# EasyEDA schematic WiringDiagram_easyEDA.json
TITLE: Sheet_1; REV: 1.0; Date: 2024-06-22; Sheet: 1/1; Drawn By: maxwelleureka; Company: Your Company
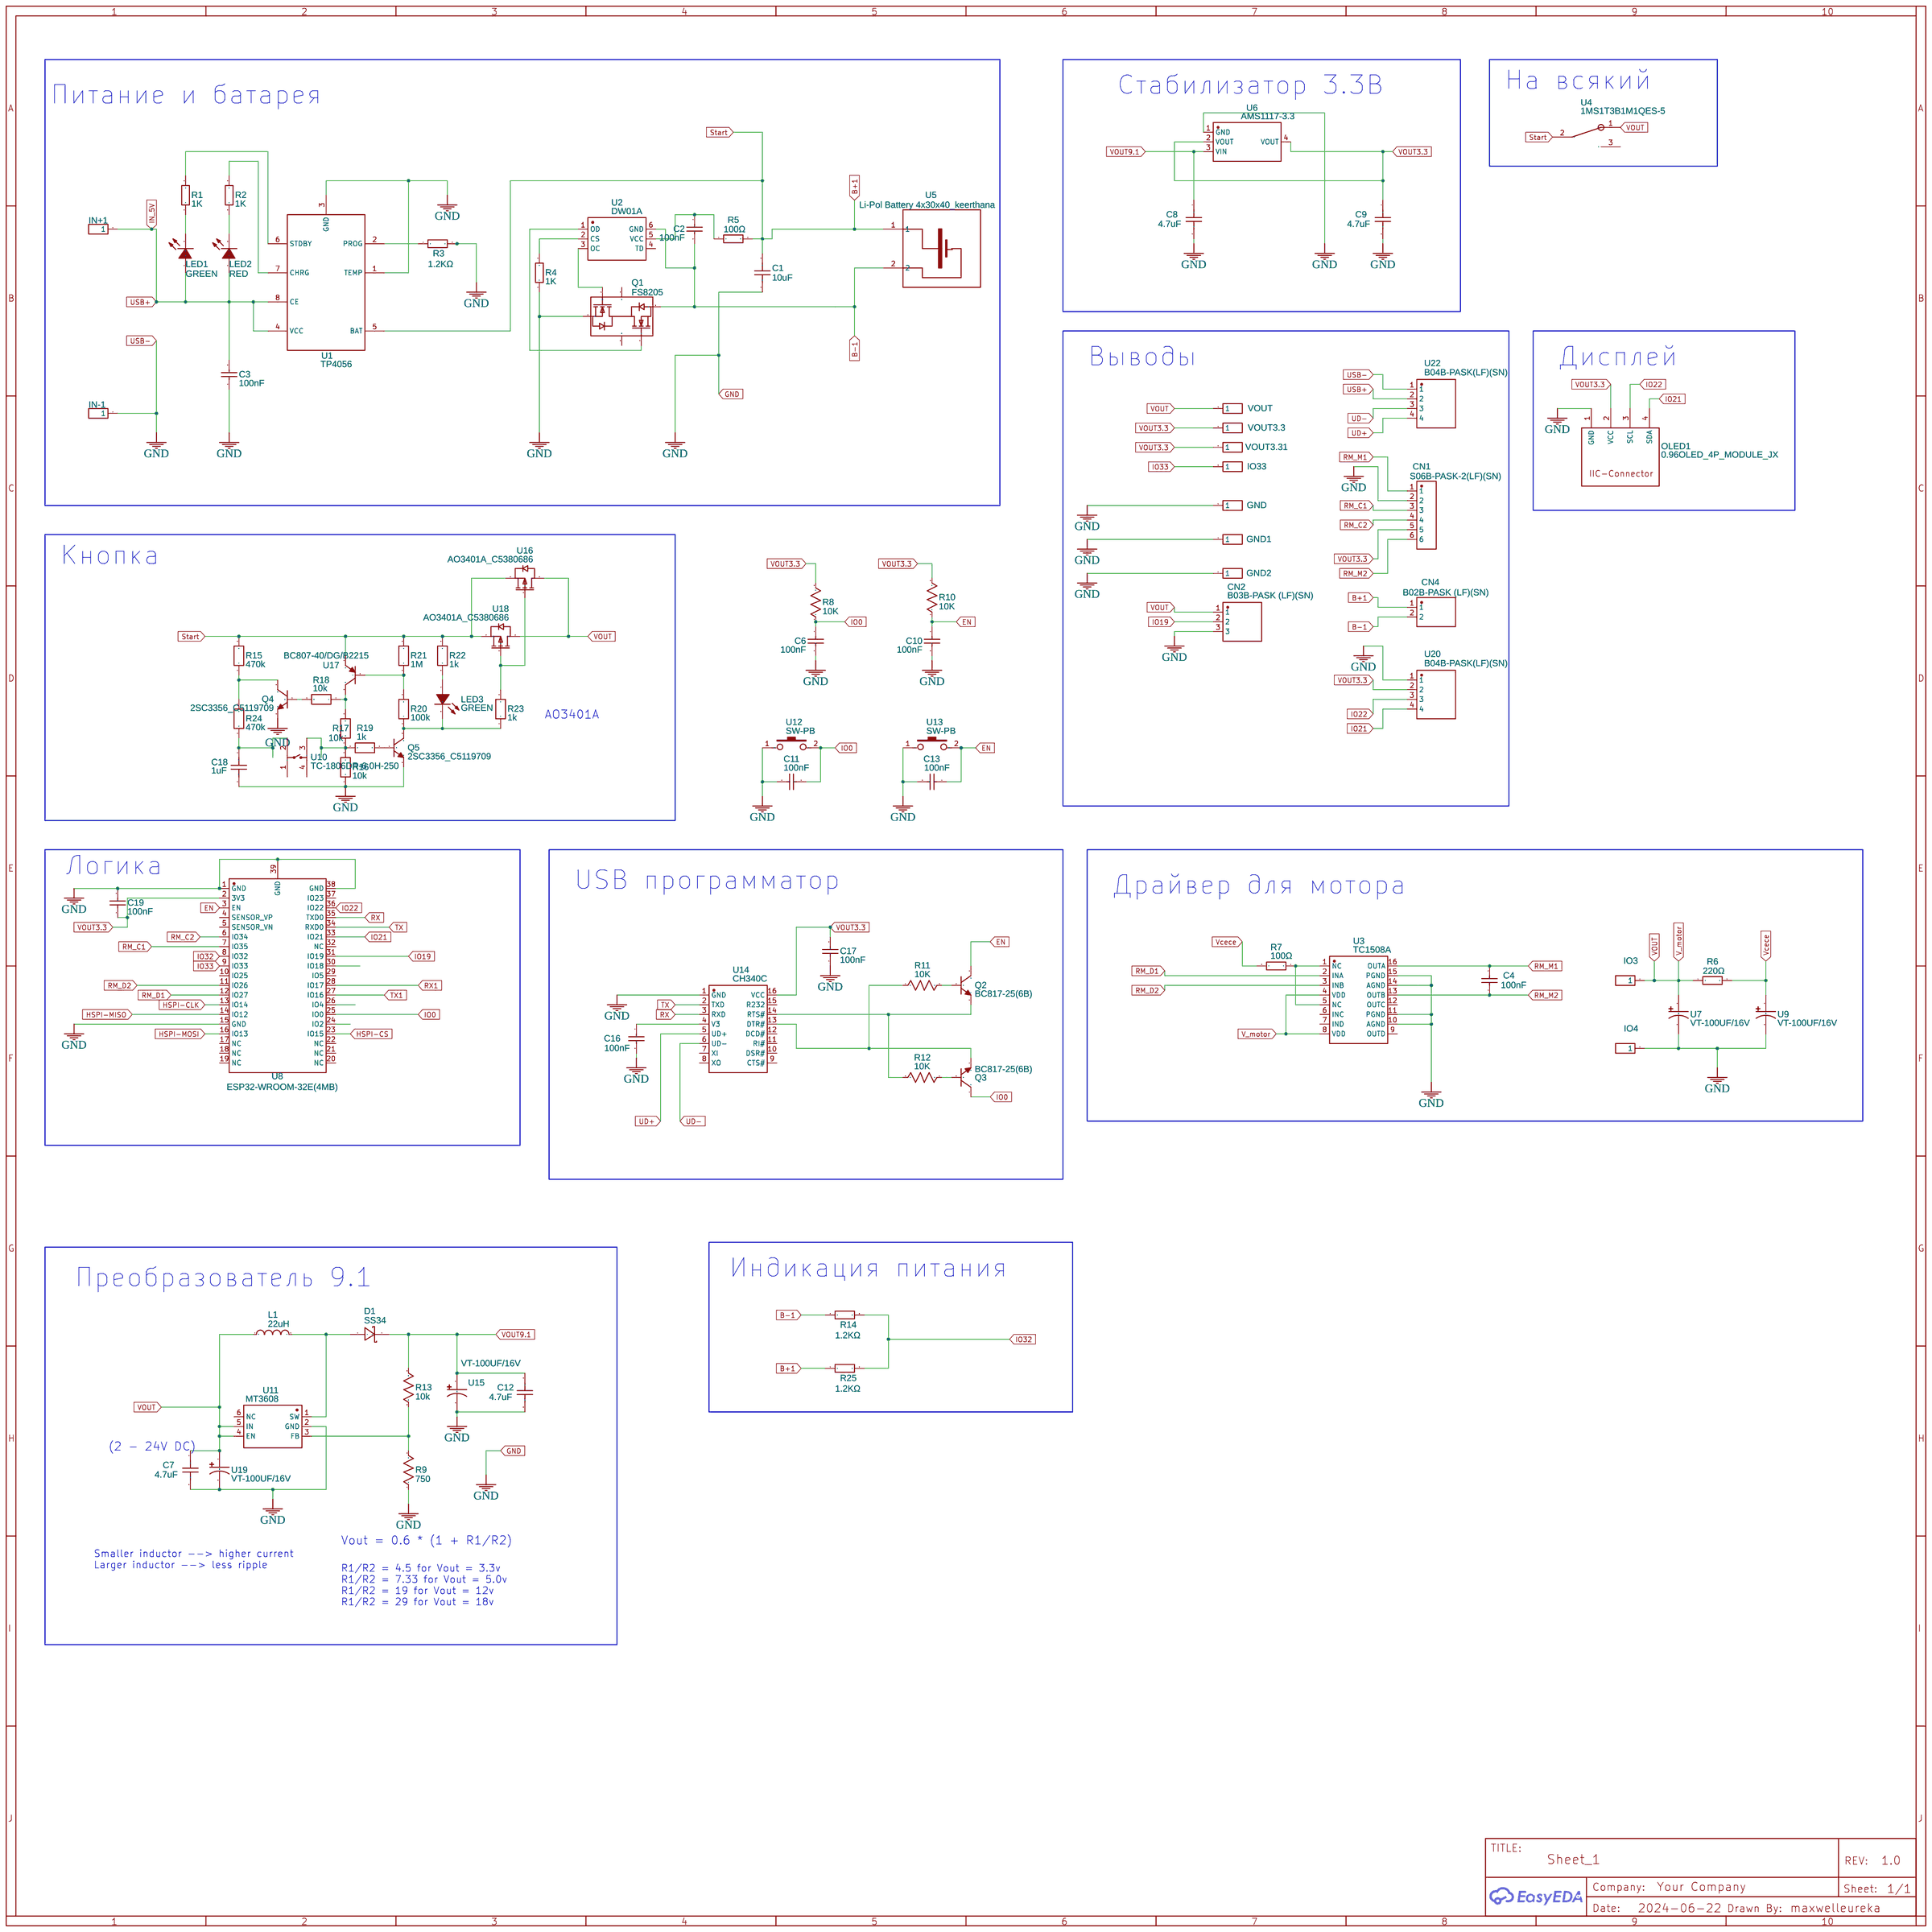
[diagram p0: schematic sheet]

## Parts
C1  10uF  [0603]
C2  100nF  [0603]
C3  100nF  [0603]
C4  100nF  [0603]
C6  100nF  [0603]
C7  4.7uF  [C0805]
C8  4.7uF  [C0805]
C9  4.7uF  [C0805]
C10  100nF  [0603]
C11  100nF  [0603]
C12  4.7uF  [C0805]
C13  100nF  [0603]
C16  100nF  [0603]
C17  100nF  [0603]
C18  1uF  [C0805]
C19  100nF  [0603]
CN1  S06B-PASK-2(LF)(SN)  [CONN-TH_6P-P2.00_S06B-PASK-2-LF-SN]
CN2  B03B-PASK (LF)(SN)  [CONN-TH_B03B-PASK-LF-SN]
CN4  B02B-PASK (LF)(SN)  [CONN-TH_B02B-PAKK-LF-SN]
D1  SS34  [SMA(DO-214AC)]
GND  Header-Male-2.54_1x1  [HDR-1X1/2.54]
GND1  Header-Male-2.54_1x1  [HDR-1X1/2.54]
GND2  Header-Male-2.54_1x1  [HDR-1X1/2.54]
IN+1  Header-Male-2.54_1x1  [HDR-1X1/2.54]
IN-1  Header-Male-2.54_1x1  [HDR-1X1/2.54]
IO3  Header-Male-2.54_1x1  [HDR-1X1/2.54]
IO4  Header-Male-2.54_1x1  [HDR-1X1/2.54]
IO33  Header-Male-2.54_1x1  [HDR-1X1/2.54]
L1  22uH  [7*7*4]
LED1  GREEN  [LED-0603]
LED2  RED  [LED-0603]
LED3  GREEN  [LED-0603]
OLED1  0.96OLED_4P_MODULE_JX  [0.96OLED_4P]
Q1  FS8205  [SOT-23-6]
Q2  BC817-25(6B)  [SOT-23-3_L2.9-W1.6-P1.90-LS2.8-BR]
Q3  BC817-25(6B)  [SOT-23-3_L2.9-W1.6-P1.90-LS2.8-BR]
Q4  2SC3356_C5119709  [SOT-23-3_L2.9-W1.3-P1.90-LS2.4-BR-2]
Q5  2SC3356_C5119709  [SOT-23-3_L2.9-W1.3-P1.90-LS2.4-BR-2]
R1  1K  [0603]
R2  1K  [0603]
R3  1.2KΩ  [0603]
R4  1K  [0603]
R5  100Ω  [0603]
R6  220Ω  [0603]
R7  100Ω  [0603]
R8  10K  [0603]
R9  750  [0603]
R10  10K  [0603]
R11  10K  [0603]
R12  10K  [0603]
R13  10k  [0603]
R14  1.2KΩ  [0603]
R15  470k  [R0805]
R16  10k  [R0805]
R17  10k  [R0805]
R18  10k  [R0805]
R19  1k  [R0805]
R20  100k  [R0805]
R21  1M  [R0805]
R22  1k  [R0805]
R23  1k  [R0805]
R24  470k  [R0805]
R25  1.2KΩ  [0603]
U1  TP4056  [SOP-8_EP_150MIL]
U2  DW01A  [SOT-23-6L]
U3  TC1508A  [SOP-16_L10.0-W3.9-P1.27-LS6.0-BL]
U4  1MS1T3B1M1QES-5  [SW-TH_1MS1T1B1M1QES-5]
U5  Li-Pol Battery 4x30x40_keerthana  [LI-POL-BATTERY-4X30X40]
U6  AMS1117-3.3  [SOT-223-3_L6.5-W3.4-P2.30-LS7.0-BR]
U7  VT-100UF/16V  [CAP-SMD_BD6.3-L6.6-W6.6-FD]
U8  ESP32-WROOM-32E(4MB)  [WIFI-SMD_ESP32-WROOM-32E]
U9  VT-100UF/16V  [CAP-SMD_BD6.3-L6.6-W6.6-FD]
U10  TC-1806DR-6.0H-250  [KEY-TH_4P-L6.0-W6.0-P4.50-LS7.8]
U11  MT3608  [SOT-23-6]
U12  SW-PB  [KEY-SMD_2P-L6.0-W3.6-P7.4-LS8.0-L]
U13  SW-PB  [KEY-SMD_2P-L6.0-W3.6-P7.4-LS8.0-L]
U14  CH340C  [SOIC-16_L9.9-W3.9-P1.27-LS6.0-BL]
U15  VT-100UF/16V  [CAP-SMD_BD6.3-L6.6-W6.6-FD]
U16  AO3401A_C5380686  [SOT-23-3_L2.9-W1.3-P1.90-LS2.4-BR]
U17  BC807-40/DG/B2215  [SOT-23-3_L2.9-W1.6-P1.90-LS2.8-BR]
U18  AO3401A_C5380686  [SOT-23-3_L2.9-W1.3-P1.90-LS2.4-BR]
U19  VT-100UF/16V  [CAP-SMD_BD6.3-L6.6-W6.6-FD]
U20  B04B-PASK(LF)(SN)  [CONN-TH_B04B-PASK-LF-SN]
U22  B04B-PASK(LF)(SN)  [CONN-TH_B04B-PASK-LF-SN]
VOUT  Header-Male-2.54_1x1  [HDR-1X1/2.54]
VOUT3  Header-Male-2.54_1x1  [HDR-1X1/2.54]  (sections 3,31)

## Library data of the parts
C1 = CL10A106MP8NNNC: Supplier: LCSC; Manufacturer: SAMSUNG; Supplier Part: C85713
C2-C4 C6 C10 C11 C13 C16 C17 C19 = 0603B104K250: Supplier: LCSC; Manufacturer: WTC; Supplier Part: C83054
C7-C9 C12 C18 = CGJ4J2X7R1E105K125AA: Contributor: lcsc; Supplier: LCSC; Supplier Part: C3905203; Manufacturer: TDK
CN1 = S06B-PASK-2(LF)(SN): Contributor: LCSC; Supplier: LCSC; Supplier Part: C495643; Manufacturer: JST; JLCPCB Part Class: Extended Part
CN2 = B03B-PASK (LF)(SN): Contributor: LCSC; Supplier: LCSC; Supplier Part: C158048; Manufacturer: JST; Manufacturer Part: B03B-PASK(LF)(SN); JLCPCB Part Class: Extended Part
CN4 = B02B-PASK (LF)(SN): Contributor: LCSC; Supplier: LCSC; Supplier Part: C158050; Manufacturer: JST; Manufacturer Part: B02B-PASK(LF)(SN); JLCPCB Part Class: Extended Part
D1 = -: Supplier: LCSC; Manufacturer: MDD; image: //image.lceda.cn/szlcsc/C8678.jpg; Supplier Part: C8678
GND GND1 GND2 IN+1 IN-1 IO3 IO4 IO33 VOUT VOUT3 = -: Supplier Part: C81276; Supplier: LCSC; Manufacturer: ReliaPro
L1 = SMRH74-220MT: Supplier: LCSC; Manufacturer: SXN; Supplier Part: C27442
LED1 LED3 = -: Supplier: LCSC; Manufacturer: LITEON; Manufacturer Part: LTST-C193TGKT-5A; Supplier Part: C12065
LED2 = -: Supplier: LCSC; Manufacturer: LITEON; Manufacturer Part: LTST-C191KRKT; Contributor: LCSC; Supplier Part: C125099
OLED1 = 0.96OLED_4P_MODULE_JX: Contributor: LCSC; Supplier: LCSC; Supplier Part: C9900004566; Manufacturer: null
Q1 = -: Supplier: LCSC; Manufacturer: FORTUNE; LCSC Assembly: Yes; image: //image.lceda.cn/szlcsc/C32254.jpg; Supplier Part: C32254
Q2 Q3 = BC817-25(6B): Supplier: LCSC; Manufacturer: ST(先科); Supplier Part: C118725; JLCPCB Part Class: Extended Part
Q4 Q5 = 2SC3356_C5119709: Contributor: lcsc; Supplier: LCSC; Supplier Part: C5119709; Manufacturer: FOSAN(富信); Manufacturer Part: 2SC3356
R1 R2 R4 = ERJ3GEYJ102V: Supplier: LCSC; Manufacturer: PANASONIC; Contributor: LCSC; Supplier Part: C180848
R3 R14 R25 = RC0603JR-071K2L: Supplier: LCSC; Manufacturer: YAGEO; Supplier Part: C114679
R5-R7 = 0603WAJ0101T5E: Supplier: LCSC; Manufacturer: UniOhm; Supplier Part: C25201
R8-R13 = Res_0603(1/10W)_US: Manufacturer Part: ?
R15-R24 = RTX051002BETP: Contributor: lcsc; Supplier: LCSC; Supplier Part: C5141148; Manufacturer: RALEC(旺诠); JLCPCB Part Class: Extended Part
U1 = -: Contributor: Guest; Supplier: LCSC; Manufacturer: TOPPOWER; LCSC Assembly: Yes; image: //image.lceda.cn/szlcsc/C16581.jpg; Supplier Part: C16581
U2 = -: Supplier: LCSC; Manufacturer: PUOLOP; Contributor: LCSC; Supplier Part: C351410
U3 = TC1508A: Contributor: lcsc; Supplier: LCSC; Supplier Part: C5142992; Manufacturer: FM(富满); JLCPCB Part Class: Extended Part
U4 = 1MS1T3B1M1QES-5: Supplier: LCSC; Supplier Part: C2913788; Manufacturer: Dailywell(德利威); Contributor: lcsc
U5 = Li-Pol Battery 4x30x40_keerthana: Manufacturer Part: 540-563; Contributor: keerthana_00; Supplier Part: 540-563; Supplier: GME; link: https://www.gme.cz/li-pol-akumulator-3-7v-400mah-4x30x35mm
U6 = AMS1117-3.3: sourceId: dwIGgezVh; Supplier: LCSC; Manufacturer: AMS; Supplier Part: C6186; JLCPCB Part Class: Basic Part
U7 U9 U15 U19 = VT-100UF/16V-20%105℃: Contributor: LCSC; Supplier: LCSC; Supplier Part: C9900003061; Manufacturer: null; Manufacturer Part: VT-100uF/16V-20%105℃; JLCPCB Part Class: Extended Part
U8 = ESP32-WROOM-32E(4MB): Contributor: LCSC; Supplier: LCSC; Supplier Part: C701341; Manufacturer: ESPRESSIF(乐鑫); Manufacturer Part: ESP32-WROOM-32E-N4; JLCPCB Part Class: Extended Part
U10 = TC-1806DR-6.0H-250: Supplier: LCSC; Supplier Part: C17702656; Manufacturer: DEALON(德艺隆); Contributor: lcsc
U11 = -: Supplier: LCSC; Manufacturer: AEROSEMI; Supplier Part: C84817
U12 U13 = SW-PB: Contributor: LCSC; Supplier: LCSC; Supplier Part: C2833203; Manufacturer: null; JLCPCB Part Class: Extended Part
U14 = CH340G: Supplier: LCSC; Manufacturer: WCH(南京沁恒); Supplier Part: C14267; JLCPCB Part Class: Extended Part
U16 U18 = AO3401A_C5380686: Contributor: lcsc; Supplier: LCSC; Supplier Part: C5380686; Manufacturer: FUXINSEMI(富芯森美); Manufacturer Part: AO3401A; JLCPCB Part Class: Extended Part
U17 = BC807-40/DG/B2215: Supplier: LCSC; Supplier Part: C3196299; Manufacturer: NXP(恩智浦); JLCPCB Part Class: Extended Part; Contributor: lcsc
U20 U22 = B04B-PASK(LF)(SN): Contributor: LCSC; Supplier: LCSC; Supplier Part: C265078; Manufacturer: JST; JLCPCB Part Class: Extended Part

## Nets
GND: C1.1 C3.1 C6.2 C7.2 C8.2 C9.2 C10.2 C11.2 C12.2 C13.2 C16.2 C17.1 C18.2 C19.2 CN1.2 CN2.3 GND.1 GND1.1 GND2.1 IN-1.1 IO4.1 OLED1.1(GND) Q1.1(S1) Q4.1(E) Q5.1(E) R3.2 R4.1 R9.1 R16.1 U1.1(TEMP) U1.3(GND) U3.10(AGND) U3.11(PGND) U3.14(AGND) U3.15(PGND) U6.1(GND) U7.2 U8.1(GND) U8.15(GND) U8.38(GND) U8.39(GND) U9.2 U11.2(GND) U12.1 U13.1 U14.1(GND) U15.2 U19.2 U20.1 U22.1
B+1: C1.2 CN4.1 R5.2 R15.2 R21.2 R22.2 R25.1 U1.5(BAT) U4.2 U5.1 U16.2(S) U17.2 U18.2(S)
B-1: C2.2 CN4.2 Q1.3(S2) R14.1 U2.6(GND) U5.2
EN: C10.1 C13.1 Q2.3(C) R10.1 U8.3(EN) U13.2
HSPI-CLK: U8.13(IO14)
HSPI-CS: U8.23(IO15)
HSPI-MISO: U8.14(IO12)
HSPI-MOSI: U8.16(IO13)
IN_5V: C3.2 IN+1.1 LED1.1(A) LED2.1(A) U1.4(VCC) U1.8(CE) U22.2
IO0: C6.1 C11.1 Q3.3(C) R8.1 U8.25(IO0) U12.2
IO19: CN2.2 U8.31(IO19)
IO21: OLED1.4(SDA) U8.33(IO21) U20.4
IO22: OLED1.3(SCL) U8.36(IO22) U20.3
IO32: R14.2 R25.2 U8.8(IO32)
IO33: IO33.1 U8.9(IO33)
RM_C1: CN1.3 U8.7(IO35)
RM_C2: CN1.4 U8.6(IO34)
RM_D1: U3.2(INA) U8.12(IO27)
RM_D2: U3.3(INB) U8.11(IO26)
RM_M1: C4.2 CN1.1 U3.16(OUTA)
RM_M2: C4.1 CN1.6 U3.13(OUTB)
RX: U8.35(TXD0) U14.3(RXD)
RX1: U8.28(IO17)
TX: U8.34(RXD0) U14.2(TXD)
TX1: U8.27(IO16)
UD+: U14.5(UD+) U22.4
UD-: U14.6(UD-) U22.3
Vcece: R6.2 R7.2 U9.1
VOUT: C7.1 CN2.1 IO3.1 L1.1 R6.1 U3.4(VDD) U3.8(VDD) U4.1 U7.1 U11.4(EN) U11.5(IN) U16.3(D) U18.3(D) U19.1 VOUT.1
VOUT3.3: C9.1 C17.2 C19.1 CN1.5 OLED1.2(VCC) R8.2 R10.2 U6.2(VOUT) U6.4(VOUT) U8.2(3V3) U14.16(VCC) U20.2 VOUT3.1
VOUT9.1: C8.1 C12.1 D1.2(K) R13.2 U6.3(VIN) U15.1
Net-(C2-1): C2.1 R5.1 U2.5(VCC)
Net-(C16-1): C16.1 U14.4(V3)
Net-(C18-1): C18.1 R24.1 U10.2
Net-(D1-1): D1.1(A) L1.2 U11.1(SW)
Net-(LED1-2): LED1.2(K) R1.1
Net-(LED2-2): LED2.2(K) R2.2
Net-(LED3-1): LED3.1(A) R22.1
Net-(LED3-2): LED3.2(K) Q5.3(C) R20.1 R23.1
Net-(Q1-4): Q1.4(G2) U2.1(OD)
Net-(Q1-6): Q1.6(G1) U2.3(OC)
Net-(Q2-1): Q2.1(B) R11.2
Net-(Q2-2): Q2.2(E) R12.2 U14.14(RTS#)
Net-(Q3-1): Q3.1(B) R12.1
Net-(Q3-2): Q3.2(E) R11.1 U14.13(DTR#)
Net-(Q4-2): Q4.2(B) R18.2
Net-(Q4-3): Q4.3(C) R15.1 R24.2
Net-(Q5-2): Q5.2(B) R19.1
Net-(R1-2): R1.2 U1.6(STDBY)
Net-(R2-1): R2.1 U1.7(CHRG)
Net-(R3-1): R3.1 U1.2(PROG)
Net-(R4-2): R4.2 U2.2(CS)
Net-(R7-1): R7.1 U3.1(NC) U3.5(NC)
Net-(R9-2): R9.2 R13.1 U11.3(FB)
Net-(R16-2): R16.2 R17.1 R19.2 U10.3
Net-(R17-2): R17.2 R18.1 U17.3
Net-(R20-2): R20.2 R21.1 U17.1
Net-(R23-2): R23.2 U16.1(G) U18.1(G)

Not connected (* = marked no-connect by the designer): Q1 2(D12) 5(D12); U2 4(TD); U3 6(INC) 7(IND) 9(OUTD) 12(OUTC); U4 3; U8 4(SENSOR_VP) 5(SENSOR_VN) 10(IO25) 17(NC) 18(NC) 19(NC) 20(NC) 21(NC) 22(NC) 24(IO2) 26(IO4) 29(IO5) 30(IO18) 32(NC) 37(IO23); U10 1 4; U11 6(NC); U14 7(XI) 8(XO) 9(CTS#) 10(DSR#) 11(RI#) 12(DCD#) 15(R232)

## Notes on the sheet
- Стабилизатор 3.3В
- На всякий
- Питание и батарея
- Выводы
- Дисплей
- Кнопка
- AO3401A
- Логика
- USB программатор
- Драйвер для мотора
- Индикация питания
- Преобразователь 9.1
- (2 - 24V DC)
- Vout = 0.6 * (1 + R1/R2)
- Smaller inductor --> higher current
  Larger inductor --> less ripple
- R1/R2 = 4.5 for Vout = 3.3v
  R1/R2 = 7.33 for Vout = 5.0v
  R1/R2 = 19 for Vout = 12v
  R1/R2 = 29 for Vout = 18v
